# Altium schematic sheet MCU_LPC804.SchDoc
size A4
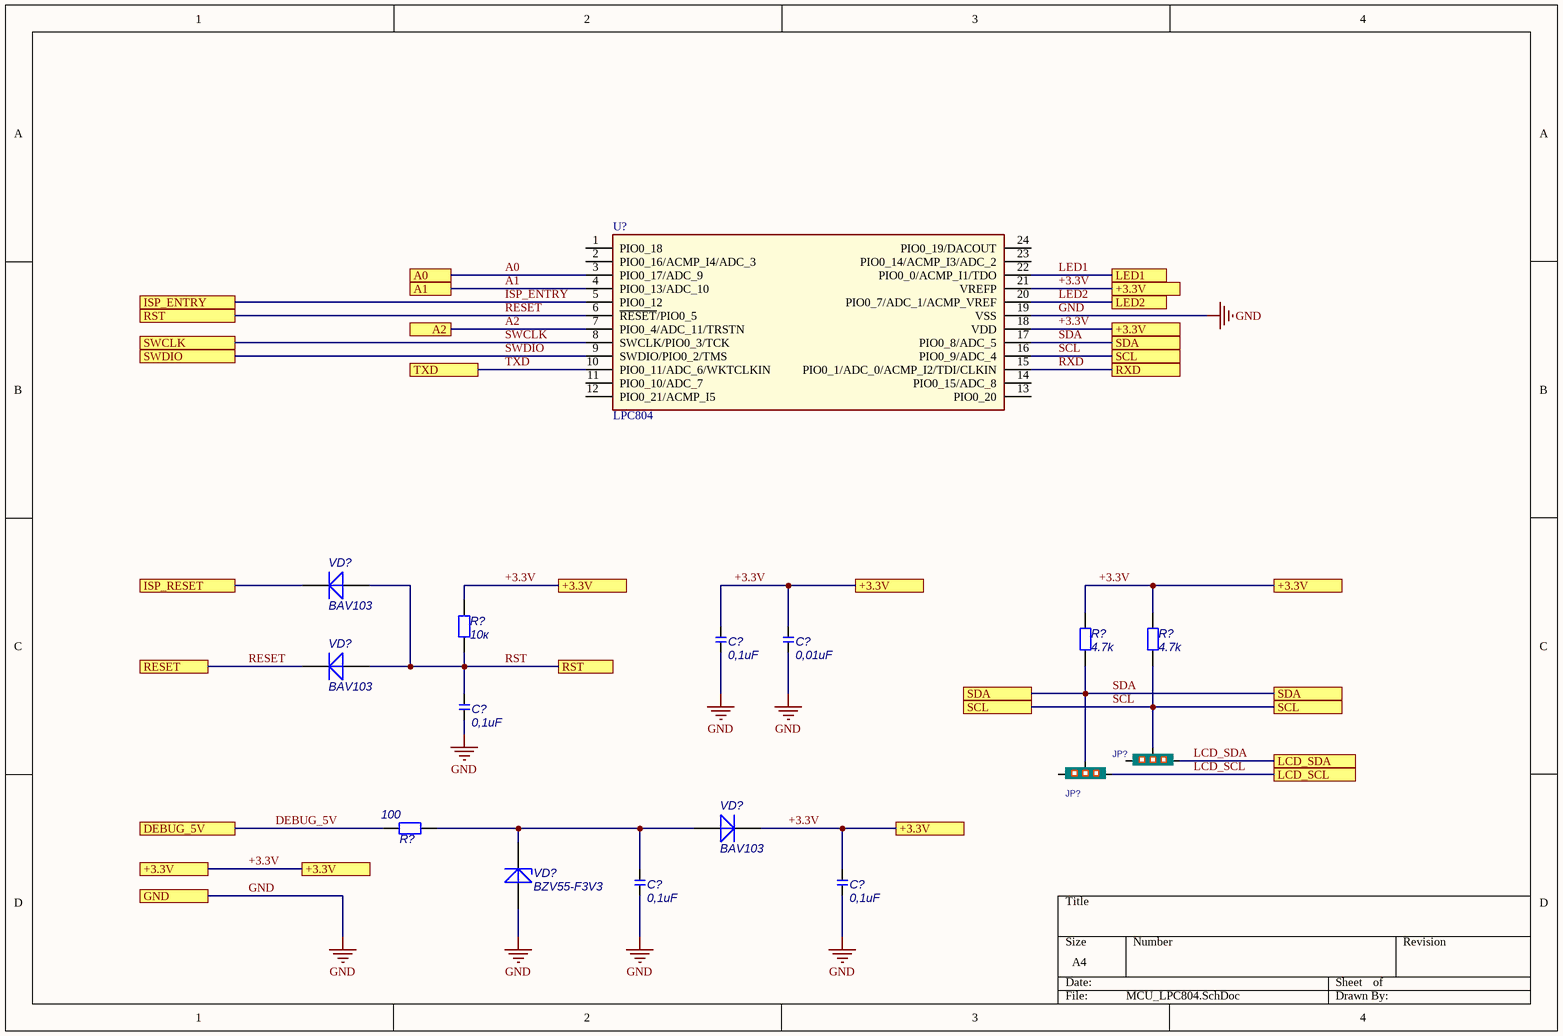
[diagram p0: MCU_LPC804.SchDoc]

## Parts
(Parts that share a designator on the sheet are numbered #1, #2 ... from top to bottom, then left to right.)
C?#1  0,1uF  [SMD1206-v1]
C?#2  0,01uF  [SMD1206-v1]
C?#3  0,1uF  [SMD1206-v1]
C?#4  0,1uF  [SMD1206-v1]
C?#5  0,1uF  [SMD1206-v1]
JP?#1  JP3_1  [Jumper_3]  (value not drawn)
JP?#2  JP3_1  [Jumper_3]  (value not drawn)
R?#1  4.7k  [SMD1206-v1]
R?#2  4.7k  [SMD1206-v1]
R?#3  10к  [SMD1206-v1]
R?#4  100  [SMD1206-v1]
U?  LPC804  [TSSOP-24_1]
VD?#1  BAV103  [SOD80C_V1]
VD?#2  BAV103  [SOD80C_V1]
VD?#3  BAV103  [SOD80C_V1]
VD?#4  BZV55-F3V3  [SOD80C_V1]

## Ports
+3.3V, A0, A1, A2, DEBUG_5V, GND, ISP_ENTRY, ISP_RESET, LCD_SCL, LCD_SDA, LED1, LED2, RESET, RST, RXD, SCL, SDA, SWCLK, SWDIO, TXD

## Nets
GND: C?#1.1 C?#2.1 C?#3.1 C?#4.1 C?#5.1 U?.19(VSS) VD?#4.1(A) ; port GND
+3.3V: C?#1.2 C?#2.2 C?#5.2 R?#1.2 R?#2.2 R?#3.1 U?.18(VDD) U?.21(VREFP) VD?#3.2(K) ; port +3.3V
A0: U?.3(PIO0_17/ADC_9) ; port A0
A1: U?.4(PIO0_13/ADC_10) ; port A1
A2: U?.7(PIO0_4/ADC_11/TRSTN) ; port A2
DEBUG_5V: R?#4.2 ; port DEBUG_5V
ISP_ENTRY: U?.5(PIO0_12) ; port ISP_ENTRY
ISP_RESET: VD?#1.2(K) ; port ISP_RESET
LCD_SCL: JP?#2.1 ; port LCD_SCL
LCD_SDA: JP?#1.1 ; port LCD_SDA
LED1: U?.22(PIO0_0/ACMP_I1/TDO) ; port LED1
LED2: U?.20(PIO0_7/ADC_1/ACMP_VREF) ; port LED2
RESET: C?#3.2 R?#3.2 U?.6(~{RESET}/PIO0_5) VD?#1.1(A) VD?#2.1(A) VD?#2.2(K) ; port RST, port RESET  [also labelled RST]
RXD: U?.15(PIO0_1/ADC_0/ACMP_I2/TDI/CLKIN) ; port RXD
SCL: JP?#1.2 R?#2.1 U?.16(PIO0_9/ADC_4) ; port SCL
SDA: JP?#2.2 R?#1.1 U?.17(PIO0_8/ADC_5) ; port SDA
SWCLK: U?.8(SWCLK/PIO0_3/TCK) ; port SWCLK
SWDIO: U?.9(SWDIO/PIO0_2/TMS) ; port SWDIO
TXD: U?.10(PIO0_11/ADC_6/WKTCLKIN) ; port TXD
NetC?#4_2: C?#4.2 R?#4.1 VD?#3.1(A) VD?#4.2(K)

Not connected (* = marked no-connect by the designer): JP?#1 3; JP?#2 3; U? 1(PIO0_18) 2(PIO0_16/ACMP_I4/ADC_3) 11(PIO0_10/ADC_7) 12(PIO0_21/ACMP_I5) 13(PIO0_20) 14(PIO0_15/ADC_8) 23(PIO0_14/ACMP_I3/ADC_2) 24(PIO0_19/DACOUT)

## Library data of the parts
C?#1 C?#3-C?#5 = SMD1206-0.1uF-50V: Конденсатор неполярный; Manufacturer: AVX; Power\Voltage: 50V; Ведомость покупных: Y; Author: Sun; Part Number: SMD1206-0.1uF-50V; DateModification: 11.10.2016; ManufacturerPartNumber: *; Value: 0,1uF; Tolerance: *; TKE: *; Корпус: SMD1206; TU/GOST: *; Примечание: *; Rem: *; SpecificationName: Конденсатор; ComponentLink1Description: Параметры; ComponentLink1URL: *; ComponentLink2Description: Сайт производителя; ComponentLink2URL: http://www.avx.com/; Component Type: Standard; Component Kind: Standard
C?#2 = SMD1206-0.01uF-50V: Конденсатор неполярный; Manufacturer: AVX; Power\Voltage: 50V; Ведомость покупных: Y; Author: Sun; Part Number: SMD1206-0.01uF-50V; DateModification: 11.10.2016; ManufacturerPartNumber: *; Value: 0,01uF; Tolerance: *; TKE: *; Корпус: SMD1206; TU/GOST: *; Примечание: *; Rem: *; SpecificationName: Конденсатор; ComponentLink1Description: Параметры; ComponentLink1URL: *; ComponentLink2Description: Сайт производителя; ComponentLink2URL: http://www.avx.com/; Component Type: Standard; Component Kind: Standard
JP?#1 JP?#2 = Jumper_3_a_pin: Part Field 1: 17-Jul-2002; Part Field 2: Re-released for DXP Platform.; Part Field 3: Altium Limited; Part Number: Jumper_3_a_pin
R?#1 R?#2 = SMD1206-4.7k-1%: Резистор постоянный; Manufacturer: Rohm Semiconductor; Tolerance: 1%; Ведомость покупных: Y; Author: Sun; Part Number: SMD1206-4.7k-1%; DateModication: 12.10.2016; ManufacturerPartNumber: *; Value: 4.7k; Power\Voltage: *; TKE: *; Корпус: SMD1206; TU/GOST: *; Примечание: *; Rem: *; SpecificationName: Резистор; ComponentLink1Description: Параметры; ComponentLink1URL: *; ComponentLink2Description: Сайт производителя; ComponentLink2URL: http://www.royalohm.com/; Component Type: Standard; Component Kind: Standard
R?#3 = SMD1206-10k-1%: Резистор постоянный; Manufacturer: Rohm Semiconductor; Tolerance: 1%; Ведомость покупных: Y; Author: Sun; Part Number: SMD1206-10k-1%; DateModication: 12.10.2016; ManufacturerPartNumber: *; Value: 10к; Power\Voltage: *; TKE: *; Корпус: SMD1206; TU/GOST: *; Примечание: *; Rem: *; SpecificationName: Резистор; ComponentLink1Description: Параметры; ComponentLink1URL: *; ComponentLink2Description: Сайт производителя; ComponentLink2URL: http://www.royalohm.com/; Component Type: Standard; Component Kind: Standard
R?#4 = SMD1206-100-1%: Резистор постоянный; Manufacturer: Rohm Semiconductor; Tolerance: 1%; Ведомость покупных: Y; Author: Sun; Part Number: SMD1206-100-1%; DateModication: 12.10.2016; ManufacturerPartNumber: *; Value: 100; Power\Voltage: *; TKE: *; Корпус: SMD1206; TU/GOST: *; Примечание: *; Rem: *; SpecificationName: Резистор; ComponentLink1Description: Параметры; ComponentLink1URL: *; ComponentLink2Description: Сайт производителя; ComponentLink2URL: http://www.royalohm.com/; Component Type: Standard; Component Kind: Standard
U? = LPC804-TSSOP24: Microcontroller; Manufacturer: NXP; SpecificationName: IC; Bills of materials: Y; Part Number: LPC804-TSSOP24; Author: Sun; DateModification: 21.12.2020; ManufacturerPartNumber: LPC804; Value: *; Tolerance: *; Power\Voltage: *; TKE: *; Package: TSSOP-24; TU/GOST: *; Note: *; Rem: *; ComponentLink1Description: Site; ComponentLink1URL: http://www.nxp.com/; ComponentLink2Description: Parameters; Component Type: Standart; Component Kind: Standart
VD?#1-VD?#3 = BAV103: Диод; Manufacturer: NXP; Корпус: SOD80C; SpecificationName: Diod; Ведомость покупных: Y; Author: Gr.; Part Number: BAV103; DateModification: 23.02.2011; ManufacturerPartNumber: BAV103; Value: *; Tolerance: *; Power\Voltage: *; TKE: *; TU/GOST: *; Примечание: *; Rem: *; ComponentLink1Description: Parametrs; ComponentLink2Description: Сайт производителя; ComponentLink2URL: http://www.nxp.com/; Component Type: Standard; Component Kind: Standard
VD?#4 = BZV55-F3V3: Стабилитрон; Manufacturer: NXP; Tolerance: 3%; Корпус: SOD80C; Ведомость покупных: Y; Author: Gr.; Part Number: BZV55-F3V3; DateModification: 28.02.2011; ManufacturerPartNumber: BZV55-F3V3; Value: *; Power\Voltage: *; TKE: *; TU/GOST: *; Примечание: *; Rem: *; SpecificationName: Стабилитрон; ComponentLink1Description: Parametrs; ComponentLink2Description: Сайт производителя; ComponentLink2URL: http://www.nxp.com/; Component Type: Standard; Component Kind: Standard